# EAGLE design X95840Shield (EAGLE 7.4.0)
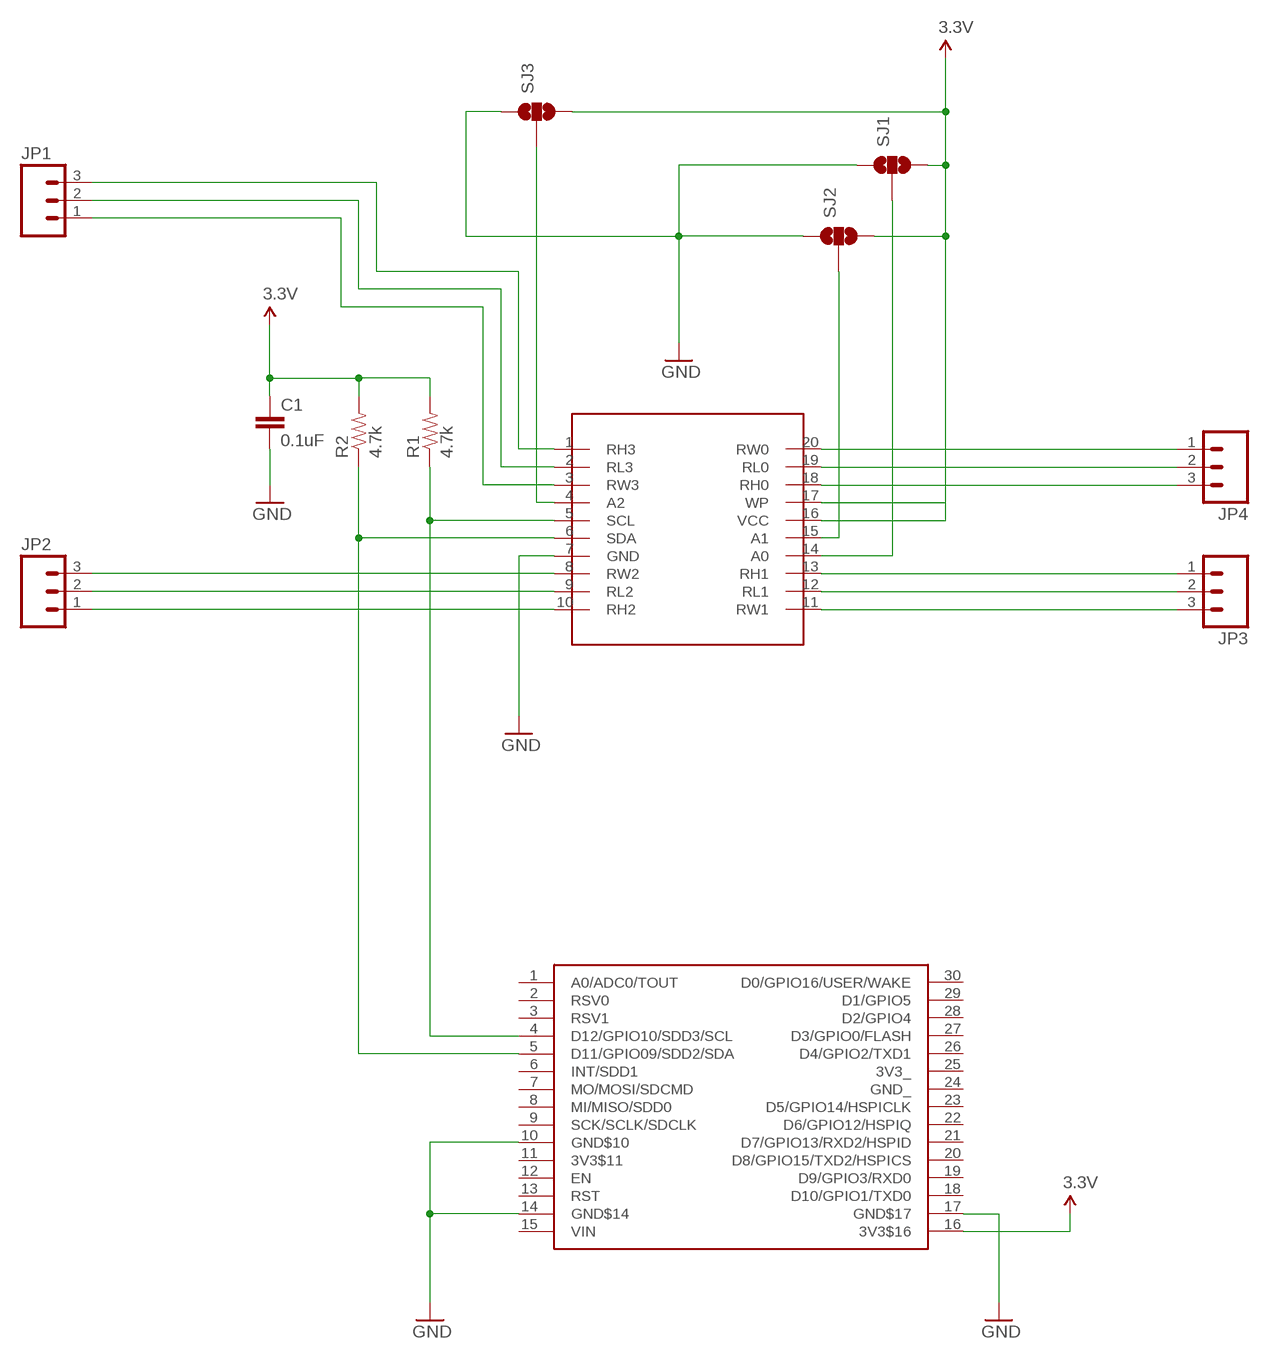
[diagram p0: schematic, sheet 1]

## Parts
C1  0.1uF  CAP0402-CAP  [0402-CAP]
JP1  M03SCREW  [SCREWTERMINAL-3.5MM-3]
JP2  M03SCREW  [SCREWTERMINAL-3.5MM-3]
JP3  M03SCREW  [SCREWTERMINAL-3.5MM-3]
JP4  M03SCREW  [SCREWTERMINAL-3.5MM-3]
R1  4.7k  RESISTOR0402-RES  [0402-RES]
R2  4.7k  RESISTOR0402-RES  [0402-RES]
SJ1  SOLDERJUMPER_2WAYPASTE1&2  [SJ_3_PASTE1&2]
SJ2  SOLDERJUMPER_2WAYPASTE1&2  [SJ_3_PASTE1&2]
SJ3  SOLDERJUMPER_2WAYPASTE1&2  [SJ_3_PASTE1&2]
U$1  NERDSHIELD  [NERDUINO_STACK]
U$3  X95840  [TSSOP20]

## Nets
3.3V: C1.1 R1.2 R2.2 SJ1.3 SJ2.3 SJ3.3 U$1.16(3V3$16) U$3.16(VCC) U$3.17(WP)
GND: C1.2 SJ1.1 SJ2.1 SJ3.1 U$1.10(GND$10) U$1.14(GND$14) U$1.17(GND$17) U$3.7(GND)
N$1: SJ3.2 U$3.4(A2)
N$2: R2.1 U$1.5(D11/GPIO09/SDD2/SDA) U$3.6(SDA)
N$3: R1.1 U$1.4(D12/GPIO10/SDD3/SCL) U$3.5(SCL)
N$7: JP1.3 U$3.1(RH3)
N$8: JP1.2 U$3.2(RL3)
N$9: JP1.1 U$3.3(RW3)
N$10: JP2.3 U$3.8(RW2)
N$11: JP2.2 U$3.9(RL2)
N$12: SJ1.2 U$3.14(A0)
N$13: SJ2.2 U$3.15(A1)
N$14: JP2.1 U$3.10(RH2)
N$15: JP3.1 U$3.13(RH1)
N$16: JP3.2 U$3.12(RL1)
N$17: JP3.3 U$3.11(RW1)
N$18: JP4.1 U$3.20(RW0)
N$19: JP4.2 U$3.19(RL0)
N$20: JP4.3 U$3.18(RH0)
Unconnected: U$1.1(A0/ADC0/TOUT) U$1.2(RSV0) U$1.3(RSV1) U$1.6(INT/SDD1) U$1.7(MO/MOSI/SDCMD) U$1.8(MI/MISO/SDD0) U$1.9(SCK/SCLK/SDCLK) U$1.11(3V3$11) U$1.12(EN) U$1.13(RST) U$1.15(VIN) U$1.18(D10/GPIO1/TXD0) U$1.19(D9/GPIO3/RXD0) U$1.20(D8/GPIO15/TXD2/HSPICS) U$1.21(D7/GPIO13/RXD2/HSPID) U$1.22(D6/GPIO12/HSPIQ) U$1.23(D5/GPIO14/HSPICLK) U$1.24(GND_) U$1.25(3V3_) U$1.26(D4/GPIO2/TXD1) U$1.27(D3/GPIO0/FLASH) U$1.28(D2/GPIO4) U$1.29(D1/GPIO5) U$1.30(D0/GPIO16/USER/WAKE)

## Library data of the parts
C1 = SparkFun:CAP: Capacitor Standard 0603 ceramic capacitor, and 0.1" leaded capacitor.
JP1-JP4 = SparkFun-Connectors:M03: Header 3 Standard 3-pin 0.1" header. Use with straight break away headers (SKU : PRT-00116), right angle break away headers (PRT-00553), swiss pins (PRT-00743), machine pins (PRT-00117), and female headers (PRT-00115). Molex polarized connector foot print use with SKU : PRT-08232 with associated crimp pins and housings.; PROD_ID: CONN-08288
R1 R2 = SparkFun:RESISTOR: Resistor Basic schematic elements and footprints for 0603, 1206, and PTH resistors.
SJ1-SJ3 = SparkFun:SOLDERJUMPER_2WAY: Solder Jumper 2 way solder jumper
U$1 = NerduinoShieldLib:NERDSHIELD
U$3 = SparkFun-AnalogIC:X95840

## Board
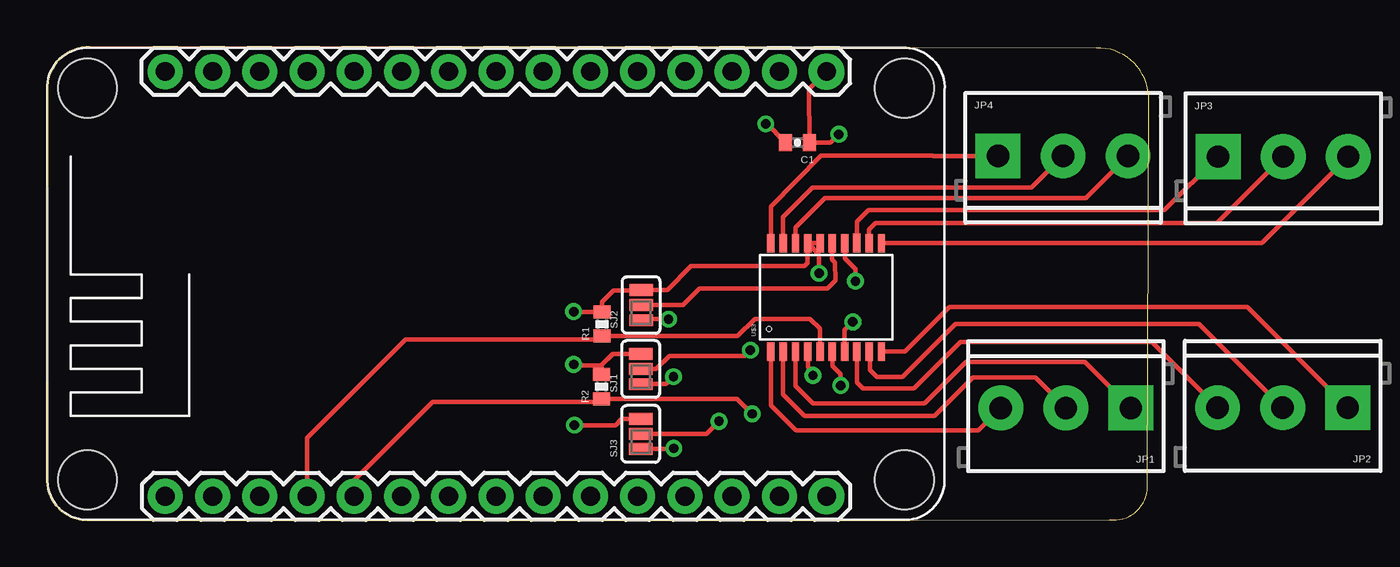
[diagram p1: board, top side]
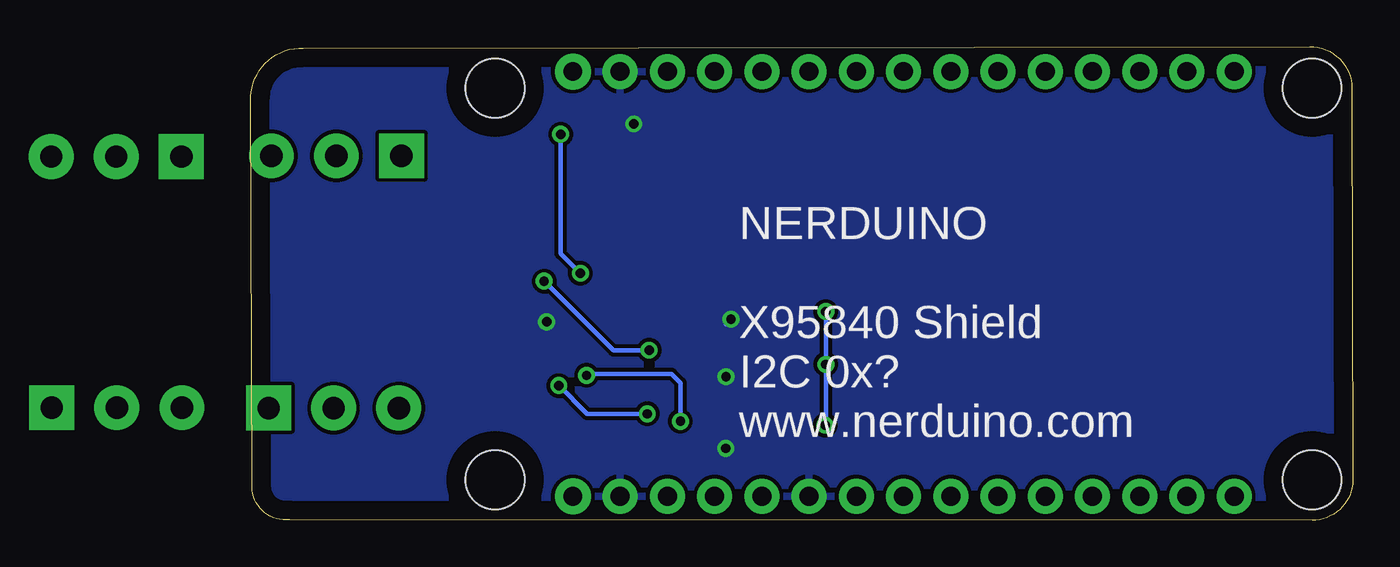
[diagram p2: board, bottom side, seen from below]

Size 59.28 x 25.5 mm. Coordinates in mm from the lower left corner, seen from the top.
Outline: 0.06,23.24 0,2.21 arc90 2.2,0 57.2,0.04 arc90 59.2,1.62 59.28,22.79 arc90 56.46,25.42 2.33,25.5 arc90 0.06,23.24
Copper layers (1*16): Top 0.035mm / dielectric 1.5mm / Bottom 0.035mm
Design rules "default": minimum track width 10mil, minimum drill 24mil, track to track 8mil, track to pad 8mil, pad to pad 8mil, via to via 8mil, smd to smd 8mil, copper to edge 40mil, drill to drill 8mil, minimum pad ring 10mil, minimum via ring 8mil, stop-mask expansion 4mil, vias tented up to drill 0mil, thermal gap 10mil

### Footprints (pad centres in the part's own frame; a part is rotated, then mirrored left to right if it is on the bottom)
0402-CAP = smd 0.7 x 0.9: 1 -0.65,0; 2 0.65,0
SCREWTERMINAL-3.5MM-3 = drill 1.2 pad 2.413 square: 1 0,0 | drill 1.2 pad 2.413: 2 3.5,0; 3 7,0
0402-RES = smd 0.7 x 0.9: 1 -0.65,0; 2 0.65,0
SJ_3_PASTE1&2 = smd 0.635 x 1.27: 1 -0.813,0; 2 0,0; 3 0.813,0
NERDUINO_STACK = drill 1.016 pad 1.88: 1 -17.78,-5.08; 2 -15.24,-5.08; 3 -12.7,-5.08; 4 -10.16,-5.08; 5 -7.62,-5.08; 6 -5.08,-5.08; 7 -2.54,-5.08; 8 0,-5.08; 9 2.54,-5.08; 10 5.08,-5.08; 11 7.62,-5.08; 12 10.16,-5.08; 13 12.7,-5.08; 14 15.24,-5.08; 17 15.24,17.78; 18 12.7,17.78; 19 10.16,17.78; 20 7.62,17.78; 21 5.08,17.78; 22 2.54,17.78; 23 0,17.78; 24 -2.54,17.78; 25 -5.08,17.78; 26 -7.62,17.78; 27 -10.16,17.78; 28 -12.7,17.78; 29 -15.24,17.78; 30 -17.78,17.78 | drill 1 pad 1.93: 15 17.78,-5.08; 16 17.78,17.78 | hole 3.175: -21.971,16.891; -21.971,-4.191; 21.971,-4.191; 21.971,16.891
TSSOP20 = smd 1 x 0.4: 1 -2.937,2.693; 2 -2.937,2.032; 3 -2.937,1.372; 4 -2.937,0.712; 5 -2.937,0.051; 6 -2.937,-0.609; 7 -2.937,-1.27; 8 -2.943,-1.93; 9 -2.937,-2.59; 10 -2.937,-3.251; 11 2.905,-3.251; 12 2.905,-2.59; 13 2.911,-1.93; 14 2.905,-1.27; 15 2.905,-0.609; 16 2.905,0.051; 17 2.905,0.712; 18 2.905,1.372; 19 2.905,2.032; 20 2.905,2.693

### Placement (x,y rotation side)
C1  40.39,20.32 180 top
JP1  58.32,6.04 180 top
JP2  69.98,6.06 180 top  (outside the outline)
JP3  63.01,19.57 0 top  (outside the outline)
JP4  51.17,19.61 0 top
R1  29.88,10.56 90 top
R2  29.85,7.19 90 top
SJ1  31.96,8.14 90 top
SJ2  31.98,11.58 90 top
SJ3  31.96,4.65 90 top
U$1  24.17,6.37 0 top
U$3  41.65,12.01 90 top

### Tracks (layer width: path | path; a pad name or v marks a point on that pad's centre or on a via)
3.3V  (via drill 0.5)
  Top 0.254: U$3.17 40.92,14.9 40.92,13.85 40.75,13.68 34.67,13.68 33.39,12.4 SJ2.3 31.95,12.36 30.49,12.36 29.88,11.75 R1.2 28.37,11.21 v28.35,11.23 | U$3.17 U$3.16 | 41.01,14.99 U$3.17 | U$1.16 41.01,23.21 C1.1 42.16,20.32 v42.61,20.77 | R2.2 29.85,8.35 30.46,8.96 | 30.46,8.96 SJ1.3 | v41.55,13.29 41.55,14.31 U$3.17 | v28.39,5.12 30.59,5.12 30.92,5.45 31.95,5.45 SJ3.3 | 30.46,8.96 30.45,8.96 29.82,8.33 28.41,8.33 v28.35,8.39
  Bottom 0.254: v42.61,20.77 42.61,14.35 v41.55,13.29 | v28.35,11.23 28.35,8.93 v28.35,8.39 28.35,5.16 v28.39,5.12
GND  (via drill 0.5)
  Top 0.254: C1.2 38.71,21.38 v38.68,21.33 | SJ1.1 33.32,7.33 v33.72,7.73 | v33.45,10.82 32.04,10.82 SJ2.1 | SJ3.1 33.23,3.84 v33.73,3.87 | U$3.7 42.92,10.24 v43.36,10.68
  Bottom 0.254: v38.68,21.33 38.8,21.29 38.63,21.46 | 33.72,10.55 v33.45,10.82 | v43.36,10.68 43.61,10.68
  pour Bottom: 0.16,25.47 59.27,25.49 59.27,0.09 0.16,0.07
N$1  (via drill 0.5)
  Top 0.254: SJ3.2 35.49,4.65 v36.17,5.33 | v41.22,7.8 41.22,7.97 40.94,8.25 U$3.4
  Bottom 0.254: v36.17,5.33 36.17,7.38 36.66,7.87 41.15,7.87 v41.22,7.8
N$2  (via drill 0.5)
  Top 0.254: U$1.5 16.55,2.16 20.77,6.38 29.69,6.38 R2.1 37.14,6.54 v37.95,5.73 | v42.71,7.25 42.71,7.87 42.27,8.31 U$3.6
  Bottom 0.254: v37.95,5.73 41.19,5.73 v42.71,7.25
N$3
  Top 0.254: U$1.4 14.01,4.44 19.31,9.74 29.71,9.74 R1.1 37.16,9.91 38.09,10.84 41.06,10.84 41.59,10.31 41.59,9.09 U$3.5
N$7
  Top 0.254: U$3.1 38.96,6.18 40.3,4.83 50.11,4.83 JP1.3
N$8
  Top 0.254: U$3.2 39.62,6.78 40.76,5.63 47.75,5.63 49.81,7.69 53.17,7.69 JP1.2
N$9
  Top 0.254: U$3.3 40.28,7.25 41.23,6.29 47.21,6.29 49.44,8.52 55.84,8.52 JP1.1
N$10
  Top 0.254: U$3.8 43.58,7.42 43.91,7.09 46.65,7.09 49.16,9.6 59.44,9.6 JP2.3
N$11
  Top 0.254: U$3.9 44.24,9 44.28,8.96 44.28,8.09 44.65,7.72 46.02,7.72 48.87,10.57 61.97,10.57 JP2.2
N$12  (via drill 0.5)
  Top 0.254: SJ1.2 32.79,8.14 33.5,8.85 37.55,8.85 v37.85,9.15 | v43.5,12.87 43.5,13.51 42.93,14.08 U$3.14
  Bottom 0.254: v37.85,9.15 39.78,9.15 v43.5,12.87
N$13
  Top 0.254: SJ2.2 34.24,11.58 35.13,12.47 41.99,12.48 42.42,12.91 42.41,13.88 42.25,14.04 U$3.15
N$14
  Top 0.254: U$3.10 46.16,9.08 48.55,11.47 64.57,11.47 JP2.1
N$15
  Top 0.254: U$3.13 43.58,16.07 44.19,16.68 60.12,16.68 JP3.1
N$16
  Top 0.254: U$3.12 44.24,15.65 44.59,16 62.94,16 JP3.2
N$17
  Top 0.254: U$3.11 65.36,14.92 JP3.3
N$18
  Top 0.254: U$3.20 38.96,16.88 41.66,19.61 47.68,19.61 47.69,19.59 51.15,19.59 JP4.1
N$19
  Top 0.254: U$3.19 39.62,16.33 41.2,17.91 52.97,17.91 JP4.2
N$20
  Top 0.254: U$3.18 40.28,15.75 41.87,17.33 55.9,17.33 JP4.3

### Text on the board
_bsilk: NERDUINO / / X95840 Shield / I2C 0x? / www.nerduino.com